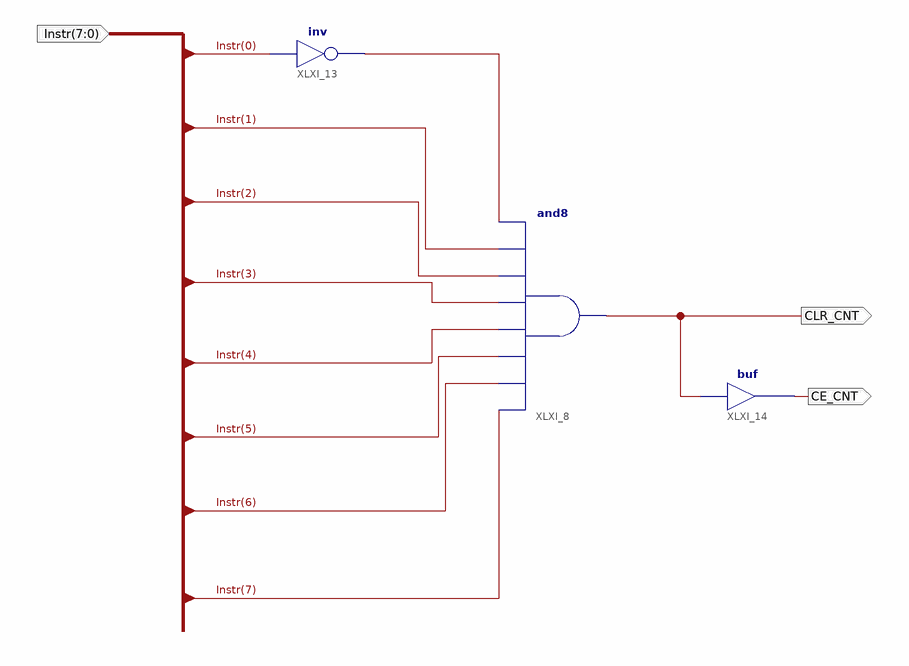
[diagram p0: schematic sheet 1]
// Xilinx ISE schematic instrHLT.sch (spartan3e) as structural Verilog: 3 symbols, 3 ports
module instrHLT (
  input  [7:0] Instr,
  output CLR_CNT,
  output CE_CNT
);

  wire XLXN_13;

  and XLXI_8 (CLR_CNT, Instr[7], Instr[6], Instr[5], Instr[4], Instr[3], Instr[2], Instr[1], XLXN_13);
  not XLXI_13 (XLXN_13, Instr[0]);
  buf XLXI_14 (CE_CNT, CLR_CNT);
endmodule
